# Altium schematic sheet Read_me.SchDoc
size A; SheetNumber: 4; SheetTotal: 4
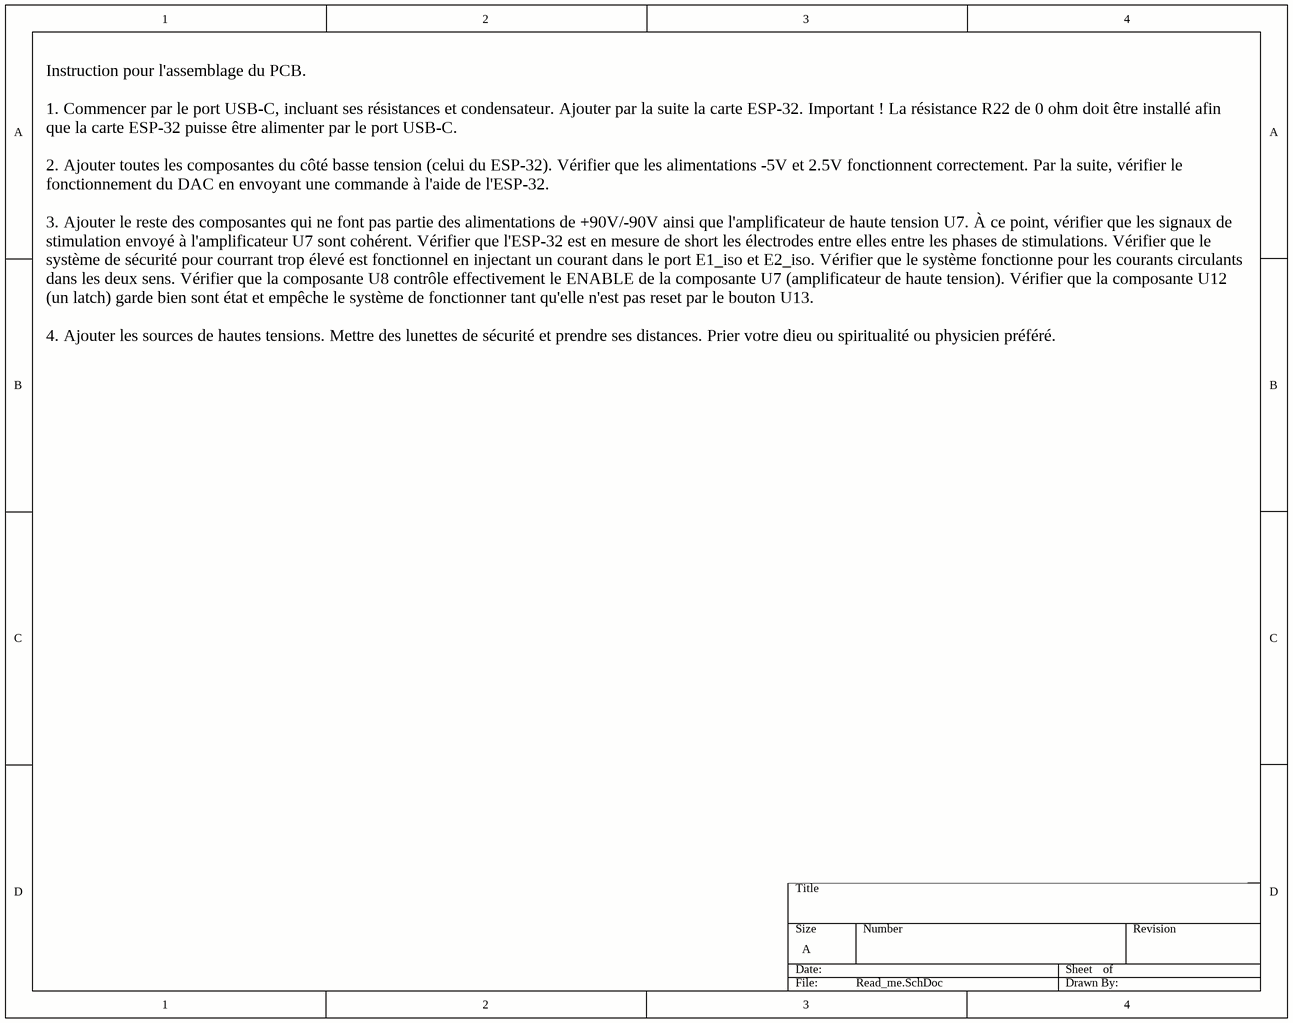
[diagram p0: Read_me.SchDoc]

## Notes on the sheet
- Instruction pour l'assemblage du PCB.
  1. Commencer par le port USB-C, incluant ses résistances et condensateur. Ajouter par la suite la carte ESP-32. Important ! La résistance R22 de 0 ohm doit être installé afin que la carte ESP-32 puisse être alimenter par le port USB-C.
  2. Ajouter toutes les composantes du côté basse tension (celui du ESP-32). Vérifier que les alimentations -5V et 2.5V fonctionnent correctement. Par la suite, vérifier le fonctionnement du DAC en envoyant une commande à l'aide de l'ESP-32.
  3. Ajouter le reste des composantes qui ne font pas partie des alimentations de +90V/-90V ainsi que l'amplificateur de haute tension U7. À ce point, vérifier que les signaux de stimulation envoyé à l'amplificateur U7 sont cohérent. Vérifier que l'ESP-32 est en mesure de short les électrodes entre elles entre les phases de stimulations. Vérifier que le système de sécurité pour courrant trop élevé est fonctionnel en injectant un courant dans le port E1_iso et E2_iso. Vérifier que le système fonctionne pour les courants circulants dans les deux sens. Vérifier que la composante U8 contrôle effectivement le ENABLE de la composante U7 (amplificateur de haute tension). Vérifier que la composante U12 (un latch) garde bien sont état et empêche le système de fonctionner tant qu'elle n'est pas reset par le bouton U13.
  4. Ajouter les sources de hautes tensions. Mettre des lunettes de sécurité et prendre ses distances. Prier votre dieu ou spiritualité ou physicien préféré.